# Altium schematic sheet IsolatorPower.SchDoc
size A4
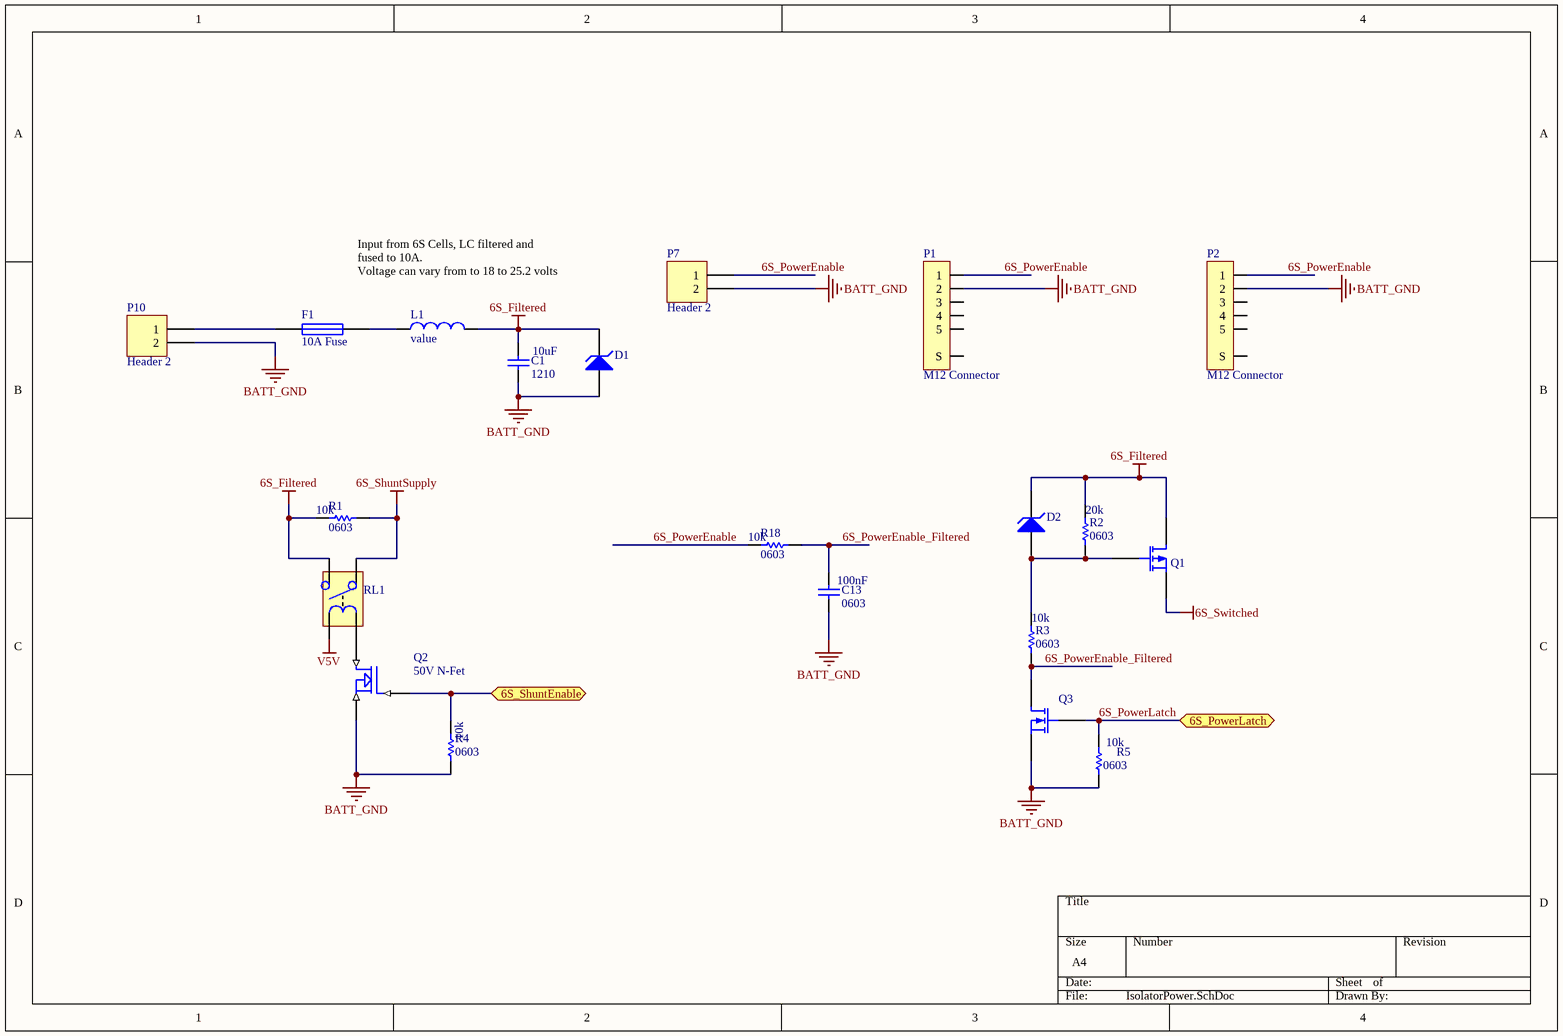
[diagram p0: IsolatorPower.SchDoc]

## Parts
C1  value 10uF  package: 1210  [1210_M]  (hidden comment: C)
C13  value 100nF  package: 0603  [0603_M]  (hidden comment: C)
D1  (no value)  [0805_M_POL]
D2  (no value)  [0805_M_POL]
F1  10A Fuse  [LITTELFUSE-154]
L1  value  [0805_M]
P1  M12 Connector  [M12_5P_VERT]
P2  M12 Connector  [M12_5P_VERT]
P7  Header 2  [HDR1X2]
P10  Header 2  [HDR1X2]
Q1  PFET 40V 10A  [TO-252 (D-Pak)]  (value not drawn)
Q2  50V N-Fet  [SOT23-3]
Q3  NFET 30V 5A  [SOT23-3]  (value not drawn)
R1  value 10k  package: 0603  [0603_M]  (hidden comment: R)
R2  value 20k  package: 0603  [0603_M]  (hidden comment: R)
R3  value 10k  package: 0603  [0603_M]  (hidden comment: R)
R4  value 10k  package: 0603  [0603_M]  (hidden comment: R)
R5  value 10k  package: 0603  [0603_M]  (hidden comment: R)
R18  value 10k  package: 0603  [0603_M]  (hidden comment: R)
RL1  Relay  [RELAY_G5Q_4PIN]  (value not drawn)

## Ports
6S_PowerLatch, 6S_ShuntEnable

## Nets
6S_Filtered: C1.1 D1.2(K) D2.2(K) L1.2(B) Q1.1(D) R1.2 R2.2 RL1.2
6S_ShuntSupply: R1.1 RL1.3
6S_Switched: Q1.3(S)
BATT_GND: C1.2 C13.2 D1.1(A) P1.2 P2.2 P7.2 P10.2 Q2.2(S) Q3.2(S) R4.1 R5.1
V5V: RL1.1
6S_PowerEnable: P1.1 P2.1 P7.1 R18.2
6S_PowerEnable_Filtered: C13.1 Q3.3(D) R3.1 R18.1
6S_PowerLatch: Q3.1(G) R5.2 ; port 6S_PowerLatch
6S_ShuntEnable: Q2.1(G) R4.2 ; port 6S_ShuntEnable
NetD2_1: D2.1(A) Q1.2(G) R2.1 R3.2
NetF1_1: F1.1 P10.1
NetF1_2: F1.2 L1.1(A)
NetQ2_3: Q2.3(D) RL1.5

Not connected (* = marked no-connect by the designer): P1 3 4 5 S; P2 3 4 5 S

## Notes on the sheet
- Input from 6S Cells, LC filtered and fused to 10A.
  Voltage can vary from to 18 to 25.2 volts

## Library data of the parts
C1 C13 = C: Default Capacitor; Supplier: Digikey
D1 D2 = D Zener: Zener Diode; Supplier 1: Digikey
F1 = FUSE
L1 = L: Inductor
P1 P2 = M12 Connector: 5 Pin
P7 P10 = Header 2: Header, 2-Pin; LatestRevisionDate: 17-Jul-2002; LatestRevisionNote: Re-released for DXP Platform.; Publisher: Altium Limited
Q1 = PFET 40V 10A: 10A 40V; Supplier 1: Digi-Key; Supplier Part Number 1: 497-2456-1-ND
Q2 = ZXM61N02F: 1.7A, 20V N-Channel Enhancement mode FET
R1-R5 R18 = R: Resistor; Supplier 1: Digikey
RL1 = Relay: 10A 30VDC Max Normally Open; Manufacturer: Omron Electronics Inc-EMC Div; Manufacturer Part Number: G5Q-1A4 DC5; Description: RELAY GEN PURPOSE SPST 10A 5V; Relay Type: General Purpose; Coil Type: Non Latching; Coil Current: 40mA; Coil Voltage: 5VDC; Contact Form: SPST-NO (1 Form A); Switching Voltage: 277VAC, 30VDC - Max; Turn On Voltage (Max): 3.75 VDC; Turn Off Voltage (Min): 0.25 VDC; Operate Time: 10ms; Release Time: 5ms; Coil Power: 200 mW; Coil Resistance: 125 Ohms; Supplier 1: Digi-Key; RoHS: RoHS Compliant; Category: Relays; Stock 1: 6697; Pricing 1: 1=3.69, 10=3.459, 25=3.0752, 50=2.9214, 100=2.7676, 250=2.46012, 500=2.30634, 1000=2.15258, 2500=2.11414 (AUD); Packaging: Bulk; Contact Rating (Current): 10A; Features: Insulation - Class F, Sealed - Fully; Mounting Type: Through Hole; Termination Style: PC Pin; Contact Material: Silver Alloy; Operating Temperature: -40°C ~ 105°C; ComponentLink1URL: http://components.omron.com/components/web/PDFLIB.nsf/0/390BE1B2058B30BF85257201007DD57C/$file/G5Q_0911.pdf; ComponentLink1Description: http://components.omron.com/components/web/PDFLIB.nsf/0/390BE1B2058B30BF85257201007DD57C/$file/G5Q_0911.pdf; Supplier Part Number 1: Z3632-ND
Q3 = NFET 30V 5A: Supplier 1: Digi-Key; Supplier Part Number 1: IRLML6344TRPBFCT-ND